# Altium schematic sheet 03_ANALOG_A.SchDoc: WMI (AFE)
size A4
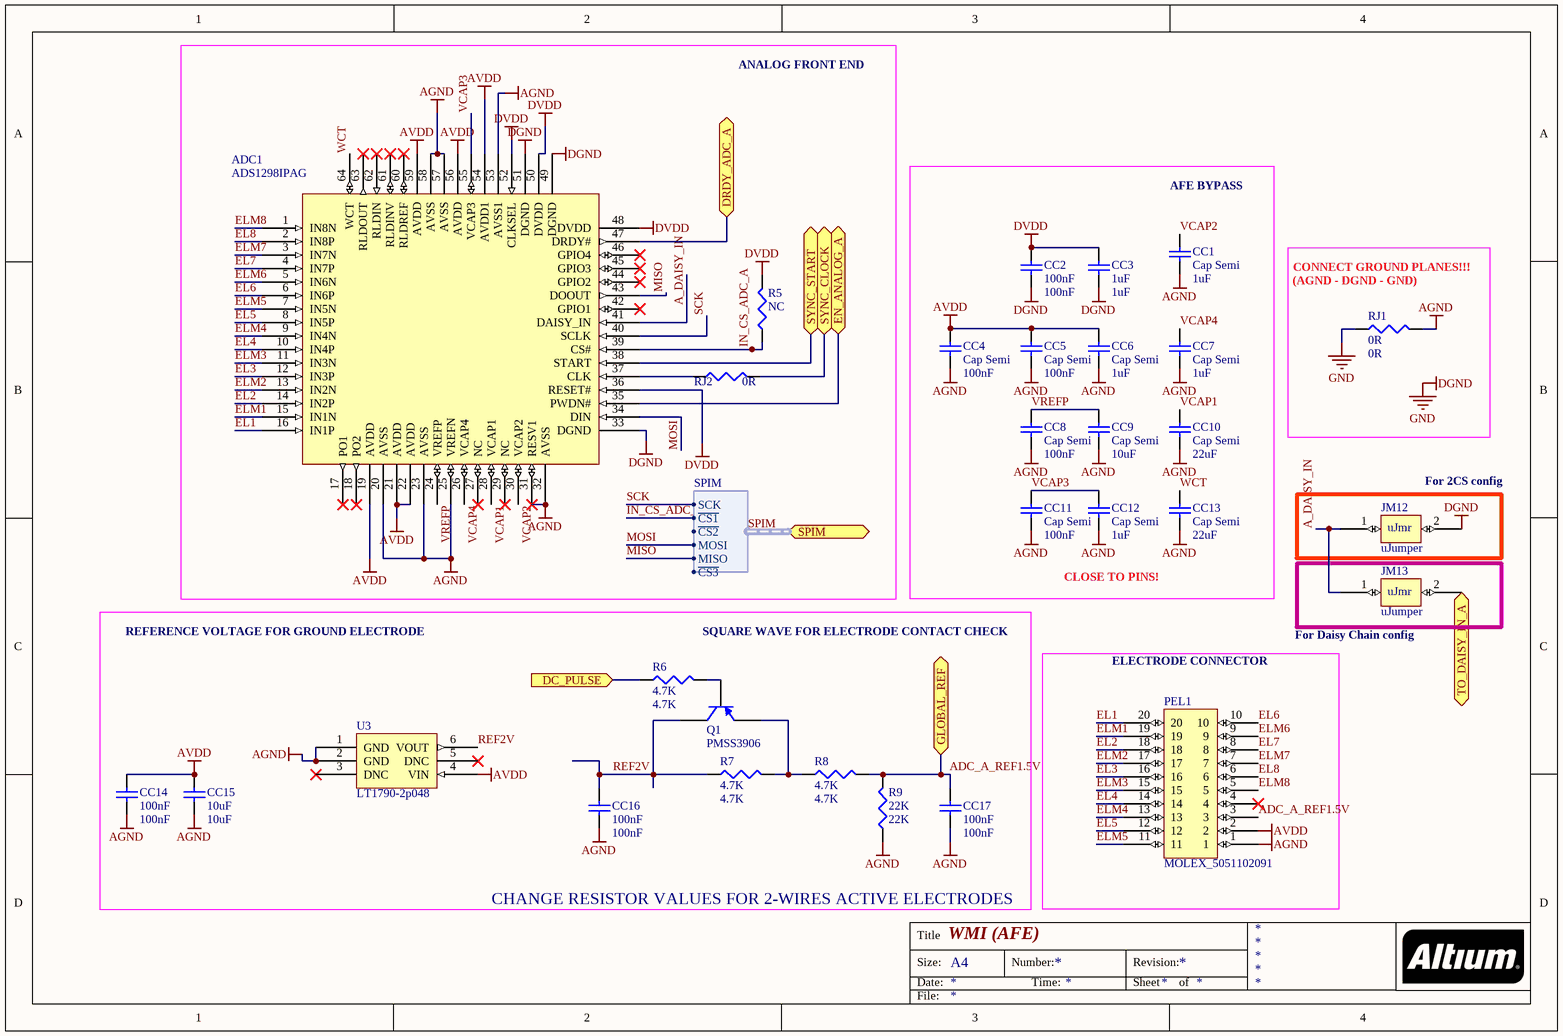
[diagram p0: 03_ANALOG_A.SchDoc]

## Parts
ADC1  ADS1298IPAG  [LQFP64_M]
CC1  Cap Semi  value 1uF  [0402]
CC2  100nF  [0402]
CC3  1uF  [0402]
CC4  Cap Semi  value 100nF  [0402]
CC5  Cap Semi  value 100nF  [0402]
CC6  Cap Semi  value 1uF  [0402]
CC7  Cap Semi  value 1uF  [0402]
CC8  Cap Semi  value 100nF  [0402]
CC9  Cap Semi  value 10uF  [0402]
CC10  Cap Semi  value 22uF  [J1-0603]
CC11  Cap Semi  value 100nF  [0402]
CC12  Cap Semi  value 1uF  [0402]
CC13  Cap Semi  value 22uF  [1608[0603]]
CC14  100nF  [0402]
CC15  10uF  [0402]
CC16  100nF  [0402]
CC17  100nF  [0402]
JM12  uJumper  [UJMPR]
JM13  uJumper  [UJMPR]
PEL1  MOLEX_5051102091  [MOLEX_5051102091]
Q1  PMSS3906  [SOT323_N]
R5  NC  [0402]
R6  4.7K  [0402]
R7  4.7K  [0402]
R8  4.7K  [0402]
R9  22K  [0402]
RJ1  0R  [0402]
RJ2  0R  [0402]
U3  LT1790-2p048  [SOT-23_A_N]

## Blocks framed on the sheet
ANALOG FRONT END: ADC1 R5 RJ2
For 2CS config: JM12
CHANGE RESISTOR VALUES FOR 2-WIRES ACTIVE ELECTRODES: CC14-CC17 Q1 R6-R9 U3
ELECTRODE CONNECTOR: PEL1

## Ports
DC_PULSE (in), DRDY_ADC_A (bidir), EN_ANALOG_A (bidir), GLOBAL_REF (bidir), SPIM (harness SPIM), SYNC_CLOCK (bidir), SYNC_START (bidir), TO_DAISY_IN_A (bidir)

## Harnesses
SPIM: SCK, ~{CS1}, ~{CS2}, MOSI, MISO, ~{CS3}

## Nets
AGND: ADC1.20(AVSS) ADC1.23(AVSS) ADC1.25(VREFN) ADC1.31(RESV1) ADC1.32(AVSS) ADC1.53(AVSS1) ADC1.57(AVSS) ADC1.58(AVSS) CC1.1 CC4.1 CC5.1 CC6.1 CC7.1 CC8.1 CC9.1 CC10.1 CC11.1 CC12.1 CC13.1 CC14.1 CC15.1 CC16.1 CC17.1 PEL1.1 R9.1 RJ1.2 U3.1(GND) U3.2(GND)
AVDD: ADC1.19(AVDD) ADC1.21(AVDD) ADC1.22(AVDD) ADC1.54(AVDD1) ADC1.56(AVDD) ADC1.59(AVDD) CC4.2 CC5.2 CC6.2 CC14.2 CC15.2 PEL1.2 U3.4(VIN)
DGND: ADC1.33(DGND) ADC1.49(DGND) ADC1.51(DGND) CC2.1 CC3.1 JM12.2 RJ1.1  [also labelled GND]
DVDD: ADC1.36(RESET#) ADC1.48(DVDD) ADC1.50(DVDD) ADC1.52(CLKSEL) CC2.2 CC3.2 R5.2
A_DAISY_IN: ADC1.41(DAISY_IN) JM12.1 JM13.1
ADC_A_REF1.5V: CC17.2 PEL1.3 R8.2 R9.2 ; port GLOBAL_REF
DC_PULSE: R6.1 ; port DC_PULSE
DRDY_ADC_A: ADC1.47(DRDY#) ; port DRDY_ADC_A
EL1: ADC1.16(IN1P) PEL1.20
EL2: ADC1.14(IN2P) PEL1.18
EL3: ADC1.12(IN3P) PEL1.16
EL4: ADC1.10(IN4P) PEL1.14
EL5: ADC1.8(IN5P) PEL1.12
EL6: ADC1.6(IN6P) PEL1.10
EL7: ADC1.4(IN7P) PEL1.8
EL8: ADC1.2(IN8P) PEL1.6
ELM1: ADC1.15(IN1N) PEL1.19
ELM2: ADC1.13(IN2N) PEL1.17
ELM3: ADC1.11(IN3N) PEL1.15
ELM4: ADC1.9(IN4N) PEL1.13
ELM5: ADC1.7(IN5N) PEL1.11
ELM6: ADC1.5(IN6N) PEL1.9
ELM7: ADC1.3(IN7N) PEL1.7
ELM8: ADC1.1(IN8N) PEL1.5
EN_ANALOG_A: ADC1.35(PWDN#) ; port EN_ANALOG_A
IN_CS_ADC_A: ADC1.39(CS#) R5.1 ; port SPIM.~{CS1}
MISO: ADC1.43(DOOUT) ; port SPIM.MISO
MOSI: ADC1.34(DIN) ; port SPIM.MOSI
REF2V: CC16.2 Q1.3(C) R7.1 U3.6(VOUT)
SCK: ADC1.40(SCLK) ; port SPIM.SCK
SYNC_CLOCK: RJ2.2 ; port SYNC_CLOCK
SYNC_START: ADC1.38(START) ; port SYNC_START
TO_DAISY_IN_A: JM13.2 ; port TO_DAISY_IN_A
VCAP1: ADC1.28(VCAP1) CC10.2
VCAP2: ADC1.30(VCAP2) CC1.2
VCAP3: ADC1.55(VCAP3) CC11.2 CC12.2
VCAP4: ADC1.26(VCAP4) CC7.2
VREFP: ADC1.24(VREFP) CC8.2 CC9.2
WCT: ADC1.64(WCT) CC13.2
NetADC1_37: ADC1.37(CLK) RJ2.1
NetQ1_1: Q1.1(B) R6.2
NetQ1_2: Q1.2(E) R7.2 R8.1

Not connected (* = marked no-connect by the designer): ADC1 17(PO1)* 18(PO2)* 27(NC)* 29(NC)* 42(GPIO1)* 44(GPIO2)* 45(GPIO3)* 46(GPIO4)* 60(RLDREF)* 61(RLDINV)* 62(RLDIN)* 63(RLDOUT)*; PEL1 4*; U3 3(DNC)* 5(DNC)*

## Buses and harness runs
harness SPIM = port SPIM

## Notes on the sheet
- AFE BYPASS
- (near RJ1) (AGND - DGND - GND)
- CONNECT GROUND PLANES!!!
- CLOSE TO PINS!
- REFERENCE VOLTAGE FOR GROUND ELECTRODE
- SQUARE WAVE FOR ELECTRODE CONTACT CHECK
- (near JM13) For Daisy Chain config
- Title
- Size:
- Date:
- A4
- Number:
- Time:
- Revision:
- Sheet
- of
- File:
- (in symbol uJumper) uJmr

## Library data of the parts
ADC1 = ADS1298
CC1-CC17 = Cap Semi: Capacitor (Semiconductor SIM Model); Published: 8-Jun-2000; LatestRevisionDate: 29-May-2009; LatestRevisionNote: IPC-7351 Footprint Added.; PackageReference: C1206; Publisher: Altium Limited; PackageDescription: Chip Capacitor
  CC2 CC14 CC16 CC17: Value: 100nF
  CC3: Value: 1uF
  CC15: Value: 10uF
Q1 = PMSS3906: PNP Switching Transistor; Published: 17-Sep-2003; LatestRevisionDate: 12-Dec-2006; LatestRevisionNote: IPC-7351 Footprint Added.; DatasheetVersion: 22-Apr-1999; PackageVersion: Apr-1999; PackageReference: SOT323; Publisher: Altium Limited; PackageDescription: 3-Pin SOT-323 Package 0.65 mm Pitch, 2.1 mm Lead Span; ComponentLink1Description: Manufacturer Link; ComponentLink1URL: http://www.semiconductors.philips.com/; ComponentLink2Description: Datasheet; ComponentLink2URL: http://www.semiconductors.philips.com/acrobat/datasheets/PMSS3906_4.pdf
R5-R9 RJ1 RJ2 = Res3: Resistor; Published: 8-Jun-2000; LatestRevisionDate: 29-May-2009; LatestRevisionNote: IPC-7351 Footprint Added.; PackageReference: J1-0603; Publisher: Altium Limited; PackageDescription: Chip Resistor
  R5: Value: NC
  R6-R8: Value: 4.7K
  R9: Value: 22K
  RJ1 RJ2: Value: 0R
U3 = LT1790